# EAGLE schematic macrotriggerschematic (EAGLE 9.7.0)
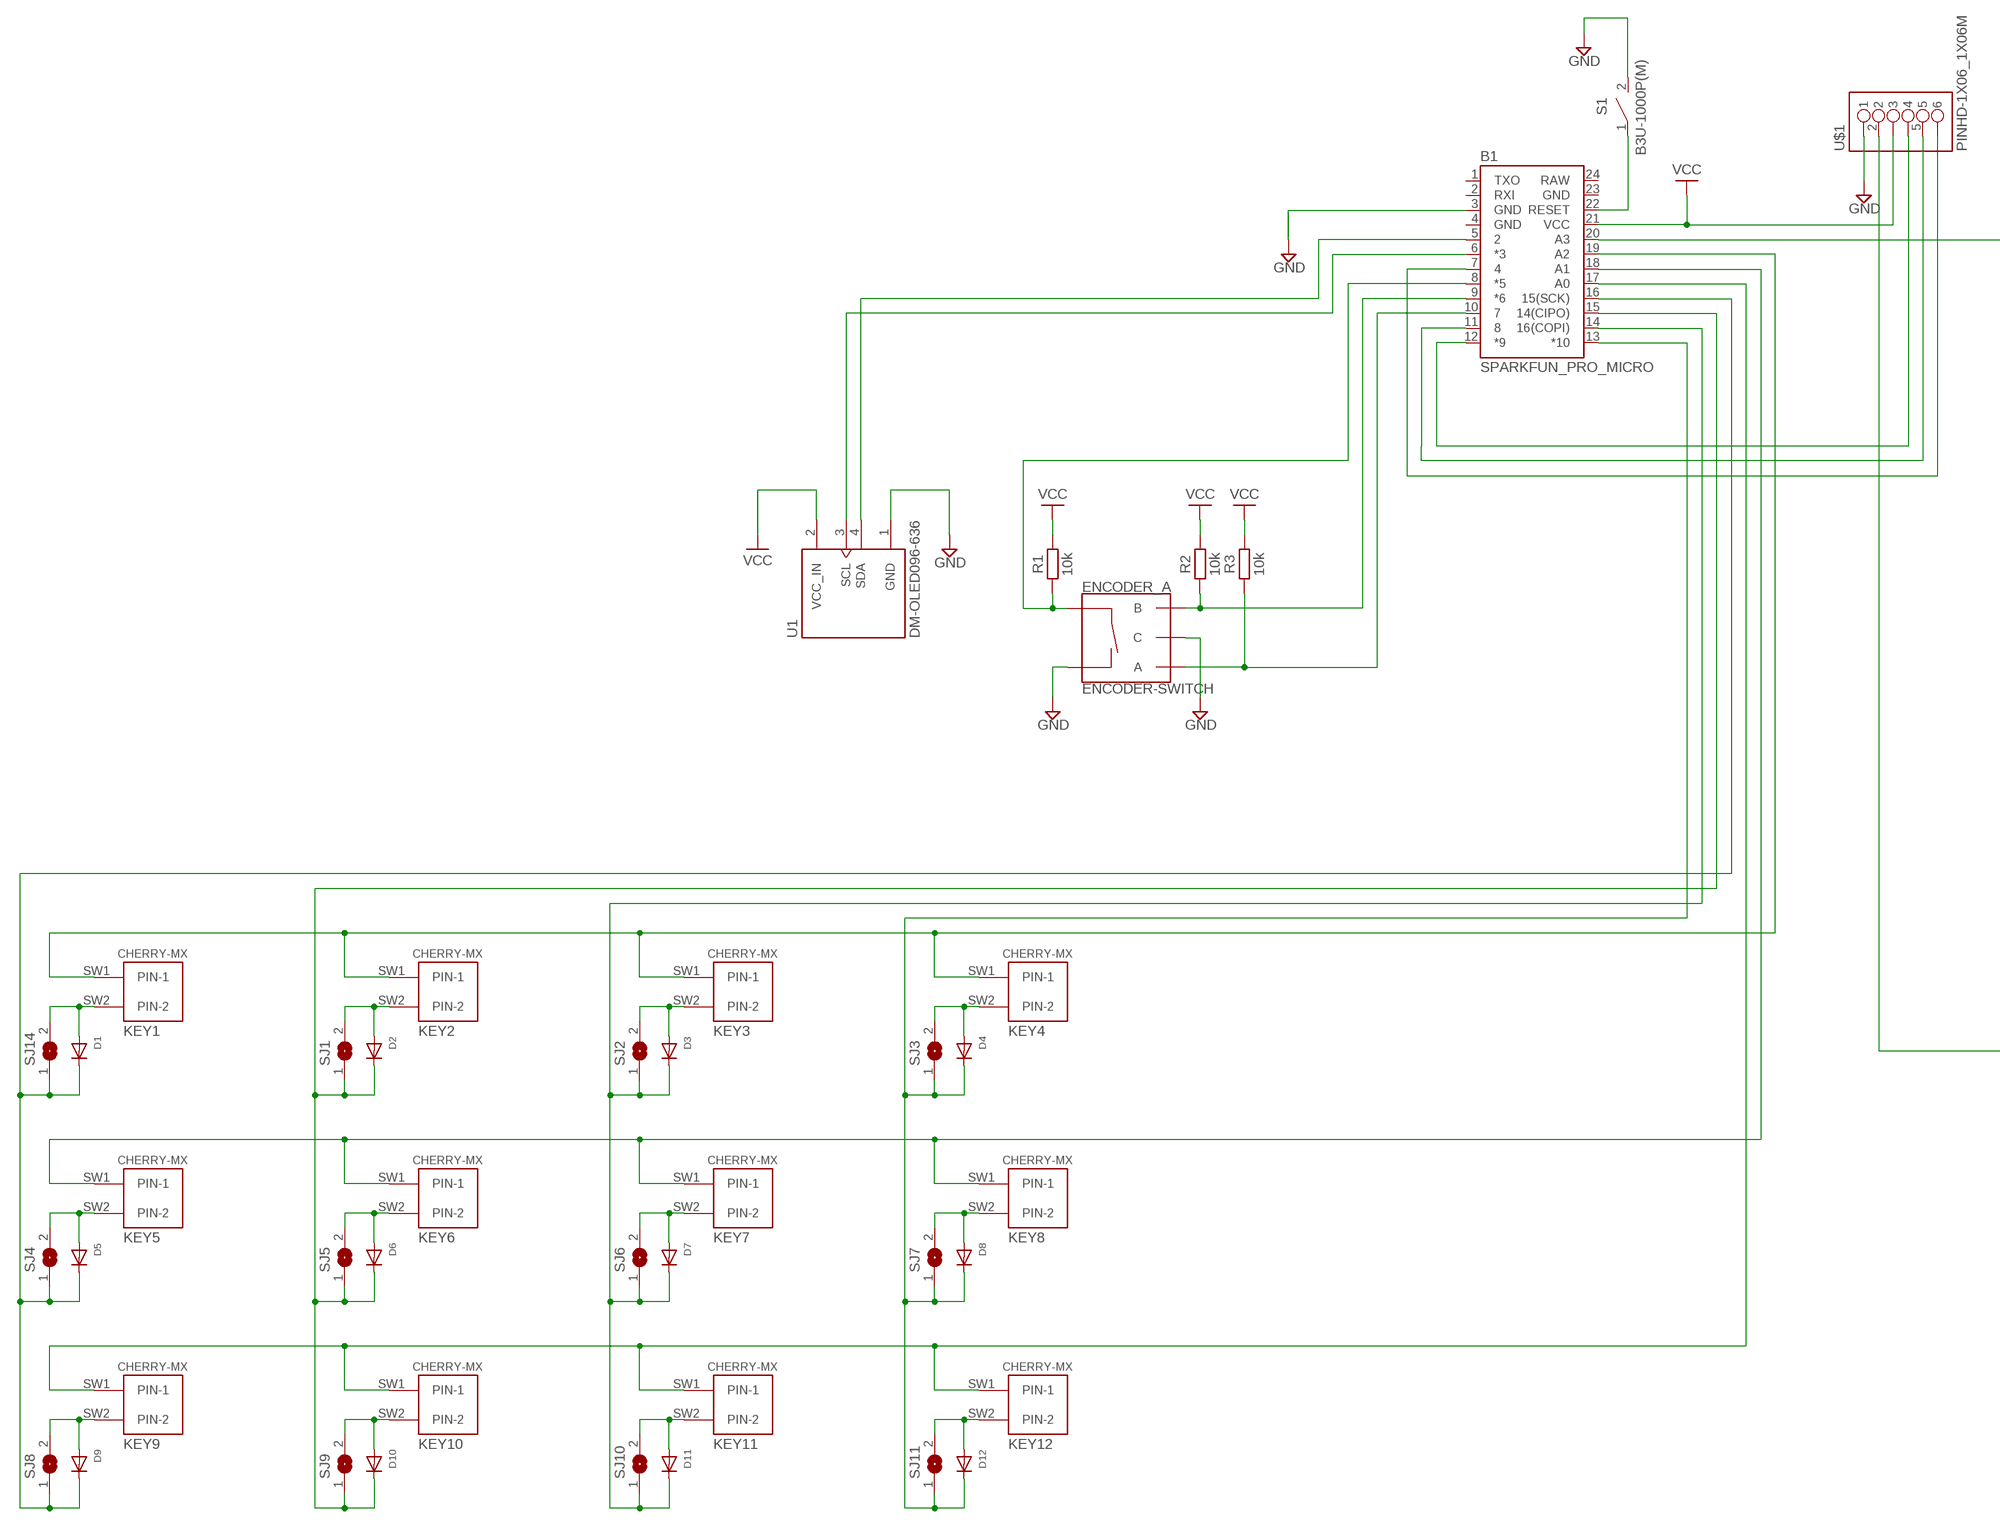
[diagram p0: schematic, sheet 1, part 1 of 2]
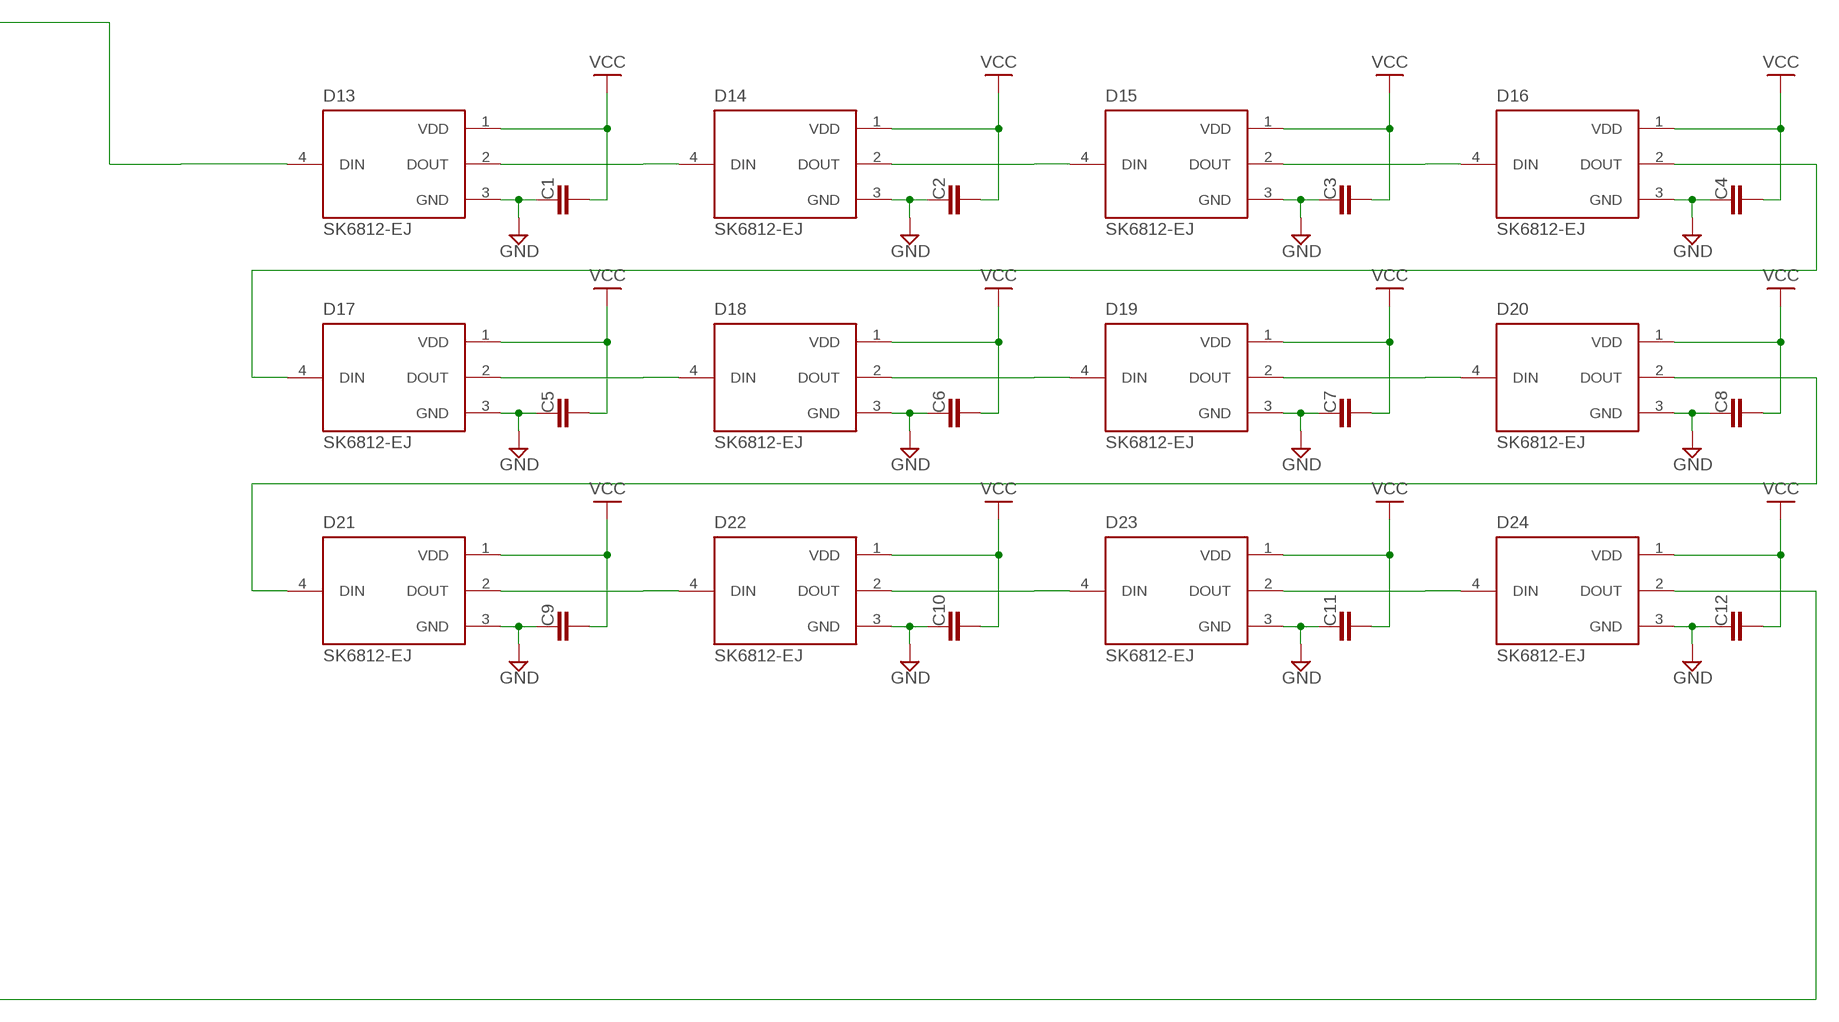
[diagram p1: schematic, sheet 1, part 2 of 2]

## Parts
B1  SPARKFUN_PRO_MICRO  [SPARKFUN_PRO_MICRO]
C1  C_CHIP-0805(2012-METRIC)  [CAPC2012X110]
C2  C_CHIP-0805(2012-METRIC)  [CAPC2012X110]
C3  C_CHIP-0805(2012-METRIC)  [CAPC2012X110]
C4  C_CHIP-0805(2012-METRIC)  [CAPC2012X110]
C5  C_CHIP-0805(2012-METRIC)  [CAPC2012X110]
C6  C_CHIP-0805(2012-METRIC)  [CAPC2012X110]
C7  C_CHIP-0805(2012-METRIC)  [CAPC2012X110]
C8  C_CHIP-0805(2012-METRIC)  [CAPC2012X110]
C9  C_CHIP-0805(2012-METRIC)  [CAPC2012X110]
C10  C_CHIP-0805(2012-METRIC)  [CAPC2012X110]
C11  C_CHIP-0805(2012-METRIC)  [CAPC2012X110]
C12  C_CHIP-0805(2012-METRIC)  [CAPC2012X110]
D1  DIODESOD-123  [SOD-123]
D2  DIODESOD-123  [SOD-123]
D3  DIODESOD-123  [SOD-123]
D4  DIODESOD-123  [SOD-123]
D5  DIODESOD-123  [SOD-123]
D6  DIODESOD-123  [SOD-123]
D7  DIODESOD-123  [SOD-123]
D8  DIODESOD-123  [SOD-123]
D9  DIODESOD-123  [SOD-123]
D10  DIODESOD-123  [SOD-123]
D11  DIODESOD-123  [SOD-123]
D12  DIODESOD-123  [SOD-123]
D13  SK6812-EJ  [LED_SK6812-E]
D14  SK6812-EJ  [LED_SK6812-E]
D15  SK6812-EJ  [LED_SK6812-E]
D16  SK6812-EJ  [LED_SK6812-E]
D17  SK6812-EJ  [LED_SK6812-E]
D18  SK6812-EJ  [LED_SK6812-E]
D19  SK6812-EJ  [LED_SK6812-E]
D20  SK6812-EJ  [LED_SK6812-E]
D21  SK6812-EJ  [LED_SK6812-E]
D22  SK6812-EJ  [LED_SK6812-E]
D23  SK6812-EJ  [LED_SK6812-E]
D24  SK6812-EJ  [LED_SK6812-E]
ENCODER_A  ENCODER-SWITCH  [ROTARY_ENC_PLAIN]
KEY1  CHERRY-MX  [CHERRY-MX]
KEY2  CHERRY-MX  [CHERRY-MX]
KEY3  CHERRY-MX  [CHERRY-MX]
KEY4  CHERRY-MX  [CHERRY-MX]
KEY5  CHERRY-MX  [CHERRY-MX]
KEY6  CHERRY-MX  [CHERRY-MX]
KEY7  CHERRY-MX  [CHERRY-MX]
KEY8  CHERRY-MX  [CHERRY-MX]
KEY9  CHERRY-MX  [CHERRY-MX]
KEY10  CHERRY-MX  [CHERRY-MX]
KEY11  CHERRY-MX  [CHERRY-MX]
KEY12  CHERRY-MX  [CHERRY-MX]
R1  10k  R_CHIP-1206(3216-METRIC)  [RESC3216X70]
R2  10k  R_CHIP-1206(3216-METRIC)  [RESC3216X70]
R3  10k  R_CHIP-1206(3216-METRIC)  [RESC3216X70]
S1  B3U-1000P(M)  B3U-X000B3U-1000P(M)1000P(M)  [B3U-1000P(M)]
SJ1  SJ  [SJ]
SJ2  SJ  [SJ]
SJ3  SJ  [SJ]
SJ4  SJ  [SJ]
SJ5  SJ  [SJ]
SJ6  SJ  [SJ]
SJ7  SJ  [SJ]
SJ8  SJ  [SJ]
SJ9  SJ  [SJ]
SJ10  SJ  [SJ]
SJ11  SJ  [SJ]
SJ14  SJ  [SJ]
U1  DM-OLED096-636  [MODULE_DM-OLED096-636]
U$1  PINHD-1X06_1X06M  [1X06]

## Nets
GND: B1.3(GND) C1.1 C2.1 C3.1 C4.1 C5.1 C6.1 C7.1 C8.1 C9.1 C10.1 C11.1 C12.1 D13.3(GND) D14.3(GND) D15.3(GND) D16.3(GND) D17.3(GND) D18.3(GND) D19.3(GND) D20.3(GND) D21.3(GND) D22.3(GND) D23.3(GND) D24.3(GND) ENCODER_A.C ENCODER_A.SW- S1.2 U1.1(GND) U$1.1
N$1: B1.22(RESET) S1.1
N$2: D1.A KEY1.SW2(PIN-2) SJ14.2
N$3: D2.A KEY2.SW2(PIN-2) SJ1.2
N$4: B1.15(14(CIPO)) D2.C D6.C D10.C SJ1.1 SJ5.1 SJ9.1
N$5: D24.2(DOUT) U$1.2
N$6: B1.10 ENCODER_A.A R3.1
N$7: D3.A KEY3.SW2(PIN-2) SJ2.2
N$8: B1.19(A2) KEY1.SW1(PIN-1) KEY2.SW1(PIN-1) KEY3.SW1(PIN-1) KEY4.SW1(PIN-1)
N$9: D13.2(DOUT) D14.4(DIN)
N$10: D4.A KEY4.SW2(PIN-2) SJ3.2
N$11: B1.20(A3) D13.4(DIN)
N$12: D5.A KEY5.SW2(PIN-2) SJ4.2
N$13: D6.A KEY6.SW2(PIN-2) SJ5.2
N$14: B1.13(*10) D4.C D8.C D12.C SJ3.1 SJ7.1 SJ11.1
N$15: D7.A KEY7.SW2(PIN-2) SJ6.2
N$16: D8.A KEY8.SW2(PIN-2) SJ7.2
N$17: D9.A KEY9.SW2(PIN-2) SJ8.2
N$18: D10.A KEY10.SW2(PIN-2) SJ9.2
N$19: B1.14(16(COPI)) D3.C D7.C D11.C SJ2.1 SJ6.1 SJ10.1
N$20: D11.A KEY11.SW2(PIN-2) SJ10.2
N$21: D12.A KEY12.SW2(PIN-2) SJ11.2
N$22: B1.11 U$1.5
N$23: B1.12(*9) U$1.4
N$24: B1.7 U$1.6
N$25: D14.2(DOUT) D15.4(DIN)
N$26: D15.2(DOUT) D16.4(DIN)
N$27: B1.18(A1) KEY5.SW1(PIN-1) KEY6.SW1(PIN-1) KEY7.SW1(PIN-1) KEY8.SW1(PIN-1)
N$28: B1.9(*6) ENCODER_A.B R2.1
N$29: B1.8(*5) ENCODER_A.SW+ R1.1
N$30: B1.5 U1.4(SDA)
N$31: B1.6(*3) U1.3(SCL)
N$32: B1.17(A0) KEY9.SW1(PIN-1) KEY10.SW1(PIN-1) KEY11.SW1(PIN-1) KEY12.SW1(PIN-1)
N$33: D16.2(DOUT) D17.4(DIN)
N$34: B1.16(15(SCK)) D1.C D5.C D9.C SJ4.1 SJ8.1 SJ14.1
N$35: D17.2(DOUT) D18.4(DIN)
N$37: D18.2(DOUT) D19.4(DIN)
N$38: D19.2(DOUT) D20.4(DIN)
N$39: D20.2(DOUT) D21.4(DIN)
N$40: D21.2(DOUT) D22.4(DIN)
N$42: D22.2(DOUT) D23.4(DIN)
N$43: D23.2(DOUT) D24.4(DIN)
VCC: B1.21(VCC) C1.2 C2.2 C3.2 C4.2 C5.2 C6.2 C7.2 C8.2 C9.2 C10.2 C11.2 C12.2 D13.1(VDD) D14.1(VDD) D15.1(VDD) D16.1(VDD) D17.1(VDD) D18.1(VDD) D19.1(VDD) D20.1(VDD) D21.1(VDD) D22.1(VDD) D23.1(VDD) D24.1(VDD) R1.2 R2.2 R3.2 U1.2(VCC_IN) U$1.3
Unconnected: B1.1(TXO) B1.2(RXI)

## Power pins joined to a net without a drawn wire
GND: B1.4(GND) B1.23(GND)
RAW: B1.24(RAW)

## Library data of the parts
B1 = SparkFun-Boards:SPARKFUN_PRO_MICRO: SparkFun Pro Micro Atmega32U4 compatible footprint. SparkFun Products: 3.3V/8MHz <https://www.sparkfun.com/products/12587> 5V/16MHz <https://www.sparkfun.com/products/12640>
C1-C12 = Capacitor:C: Capacitor - Generic; CATEGORY: Capacitor; PACKAGE_SIZE: 0805; PACKAGE_TYPE: SMD; SUBCATEGORY: Ceramic Capacitors; TYPE: MLCC
D1-D12 = adafruit:DIODE: Diode SMADIODE - SMA Surface Mount Package 20V 1A Schottky Diode Digikey: 641-1014-6-ND DO-1N4148 - Through Hole Small Current Diode SOD-123 20V 1 A (.5mV Vf) Schottky Diode - Digikey: MBRX120TPMSCT-ND SOD-323 10V 570mA (.38mV Vf, 3ns) Schottky Diode - Digikey: ZLLS410CT-ND SOD-523 30V 30mA Schottky Diode (RB751S-40TE61) - Digikey: RB751S-40TE61CT-ND SOT23-R/W - SOT23 Package (R = Solder Paste/Reflow Ovens, W = Hand-Soldering) BAT54Film 40V 300mA - Digikey: 497-7162-1-ND
D13-D24 = SK6812-E:SK6812-E: Check availability <https://pricing.snapeda.com/parts/SK6812-E/DONGGUANG%20OPSCO%20OPTOELECTRONICS%20CO.%2C%20LTD/view-part?ref=eda>; AVAILABILITY: Not in stock; CHECK_PRICES: https://www.snapeda.com/parts/SK6812-E/DONGGUANG+OPSCO+OPTOELECTRONICS+CO.%252C+LTD/view-part/?ref=eda; DESCRIPTION: SK6812MINI-E is a smart LED control circuit and light emitting circuit in one controlled LED source, which has the shape of a 3528 LED chip.; MF: DONGGUANG OPSCO OPTOELECTRONICS CO., LTD; MP: SK6812-E; PACKAGE: Package; PRICE: None; SNAPEDA_LINK: https://www.snapeda.com/parts/SK6812-E/DONGGUANG+OPSCO+OPTOELECTRONICS+CO.%252C+LTD/view-part/?ref=snap
ENCODER_A = SparkFun-Switches_ryan_edits:ENCODER-SWITCH: Rotary Encoder w/ Select Switch Encoders rotate similarly to potentiometers, but they’re different from potentiometers in that an encoder has full rotation without limits. They output gray code so that you can tell how much and in which direction the encoder has been turned. This encoder includes a push-down select switch built into the shaft. SparkFun Products Rotary Encoder <https://www.sparkfun.com/products/9117> (COM-09117); SF_SKU: COM-09117
KEY1-KEY4 KEY6-KEY12 = cherrymx:CHERRY-MX: Cherry MX series keyswitch
KEY5 = cherrymx:CHERRY-MX: Cherry MX series keyswitch; SPICEPREFIX: B
R1-R3 = Resistor:R: Resistor Fixed - Generic; CATEGORY: Resistor; SUB-CATEGORY: Fixed
S1 = Switch:B3U-X000: Ultra-small Tactile Switch Contact form : SPST-NO Datasheet <https://omronfs.omron.com/en_US/ecb/products/pdf/en-b3u.pdf>; CATEGORY: SWITCH; DESCRIPTION: Ultra-small Surface-mounting Tactile Switches with High Contact Reliability; MANUFACTURER: OMRON; OPERATING_TEMPERATURE: -25°C to +70°C at 60%RH max; PART_STATUS: ACTIVE; ROHS_COMPLIANCE: RoHS Compliant; SERIES: B3U; TYPE: Tactile
SJ1-SJ11 SJ14 = jumper:SJ: SMD solder JUMPER
U1 = DM-OLED096-636:DM-OLED096-636: Check availability <https://pricing.snapeda.com/parts/DM-OLED096-636/Display%20Module/view-part?ref=eda>; AVAILABILITY: Not in stock; CHECK_PRICES: https://www.snapeda.com/parts/DM-OLED096-636/Display+Module/view-part/?ref=eda; DESCRIPTION: 0.96” 128 X 64 MONOCHROME GRAPHIC OLED DISPLAY MODULE - I2C; MF: Display Module; MP: DM-OLED096-636; PACKAGE: Package; PRICE: None; SNAPEDA_LINK: https://www.snapeda.com/parts/DM-OLED096-636/Display+Module/view-part/?ref=snap
U$1 = Tinkercad:PINHD-1X06